# EasyEDA Pro project PCB.epro

# Schematic Schematic1
Board Name: Board1; Create Date: 2025-05-08; Page Name: 底板; Project Name: ESP32-C6红外温度报警底板; Schematic Name: Schematic1; Update Date: 2025-05-09; Company: 嘉立创EDA; Page Size: A4; Version: V1.0
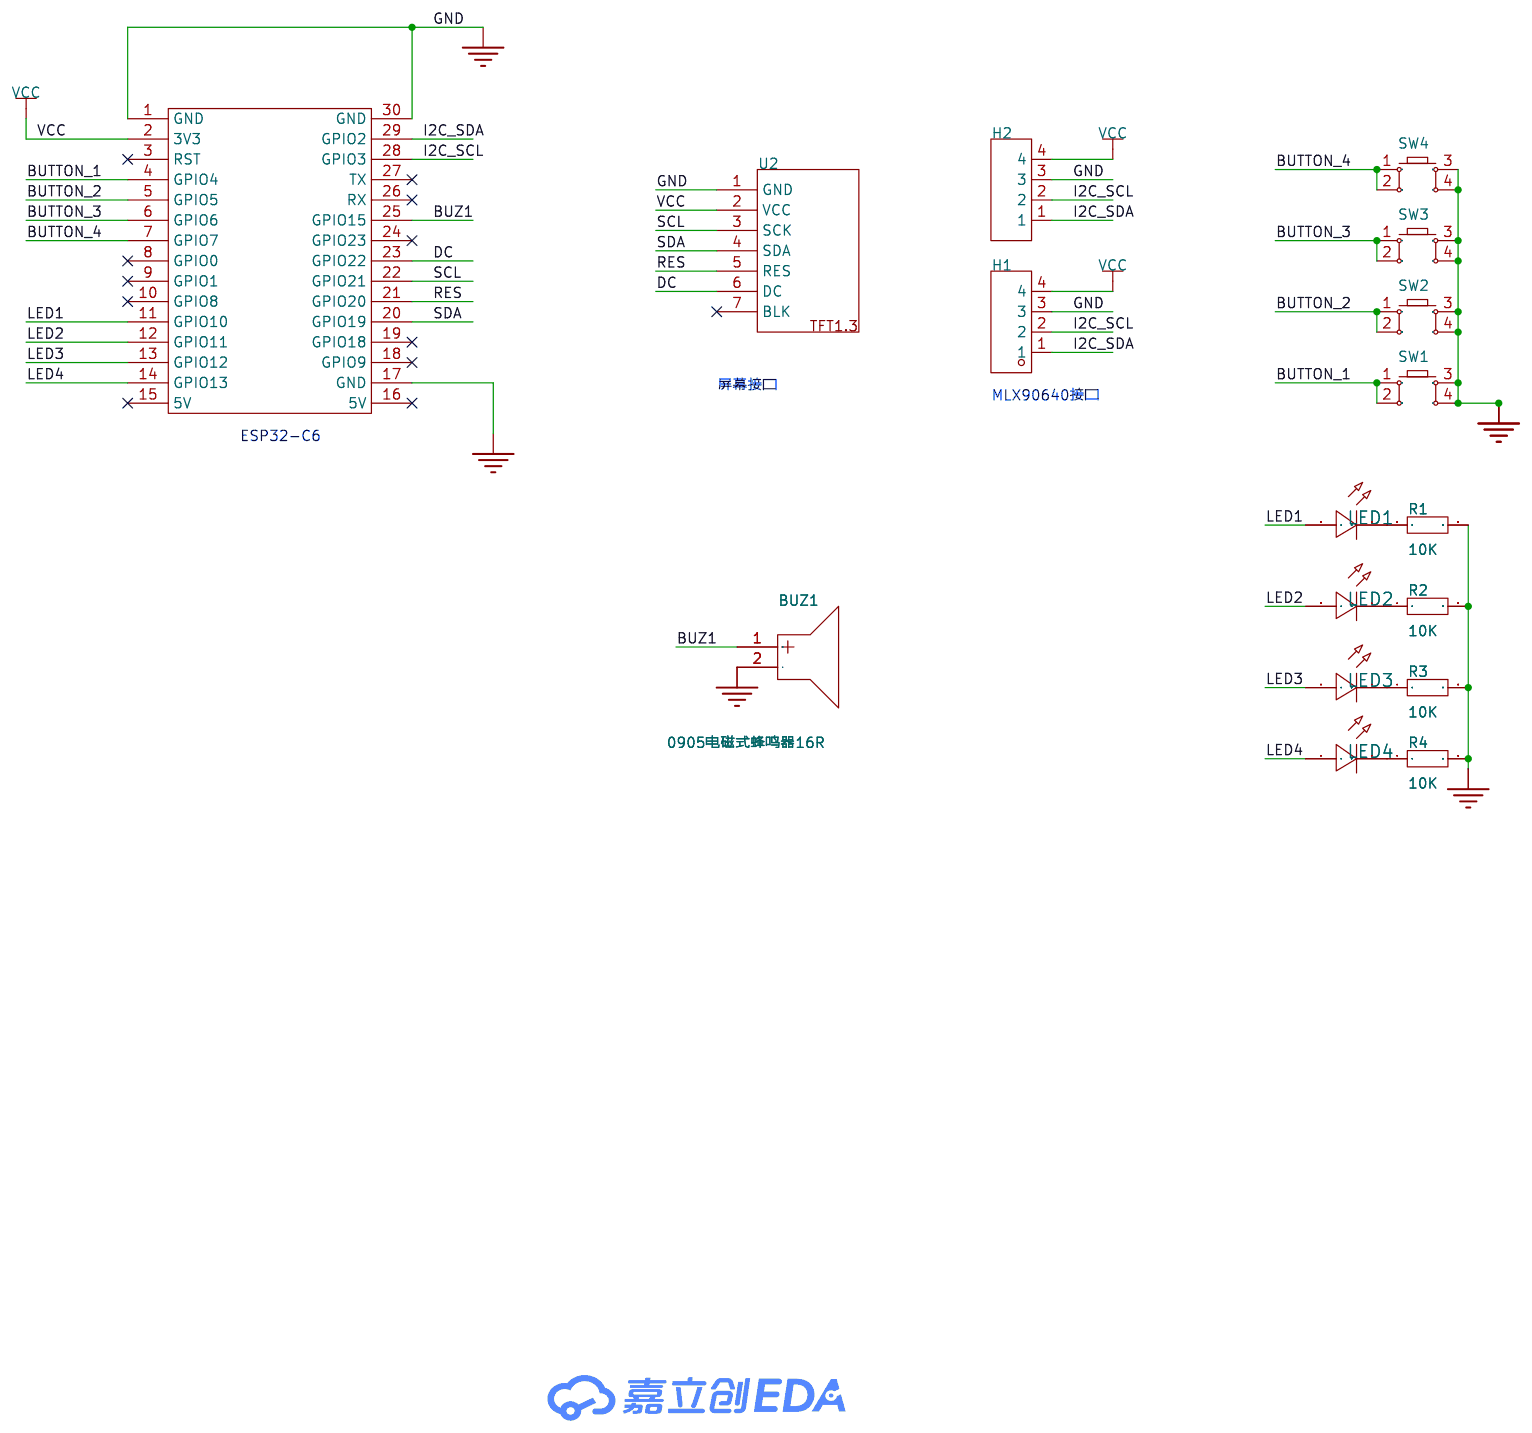
[diagram p0: schematic sheet]

## Parts
BUZ1  0905电磁式蜂鸣器16R  [BUZ-TH_BD9.0-P4.00-D0.6-FD]
H1  -  [HDR-TH_4P-P2.54-V-F]
H2  -  [HDR-TH_4P-P2.54-V-M]
LED1  -  [LED_0603]
LED2  -  [LED_0603]
LED3  -  [LED_0603]
LED4  -  [LED_0603]
R1  10K  [R0603]
R2  10K  [R0603]
R3  10K  [R0603]
R4  10K  [R0603]
SW1  -  [SW-SMD_4P-L6.0-W6.0-P4.50-LS9.0-2]
SW2  -  [SW-SMD_4P-L6.0-W6.0-P4.50-LS9.0-2]
SW3  -  [SW-SMD_4P-L6.0-W6.0-P4.50-LS9.0-2]
SW4  -  [SW-SMD_4P-L6.0-W6.0-P4.50-LS9.0-2]
U2  -  [tft1.3寸]
U3  -  [ESP32-C6-开发板]

## Library data of the parts
BUZ1 = 0905电磁式蜂鸣器16R: Supplier Part: C9900018545; Supplier Footprint: TH-2P; JLCPCB Part Class: 扩展库; Supplier: LCSC
H1 = HDR-F_2.54_1x4P: Supplier Part: C2718488; Supplier Footprint: 插件
H2 = HDR-M_2.54_1x4P: Supplier Part: C492403; Supplier Footprint: 插件
LED1-LED4 = LED_0603-R: Supplier Footprint: 0603
R1-R4 = Res_0603: Supplier Footprint: 0603
SW1-SW4 = Key_SMD_6x6x6.5: Supplier Footprint: SMD
U2 = tft1.3寸
U3 = ESP32-C6-开发板

## Nets
GND: BUZ1.2(-) H1.3 H2.3 R1.2 R2.2 R3.2 R4.2 SW1.3 SW1.4 SW2.3 SW2.4 SW3.3 SW3.4 SW4.3 SW4.4 U2.1(GND) U3.1(GND) U3.17(GND) U3.30(GND)
VCC: H1.4 H2.4 U2.2(VCC) U3.2(3V3)
BUTTON_1: SW1.1 SW1.2 U3.4(GPIO4)
BUTTON_2: SW2.1 SW2.2 U3.5(GPIO5)
BUTTON_3: SW3.1 SW3.2 U3.6(GPIO6)
BUTTON_4: SW4.1 SW4.2 U3.7(GPIO7)
BUZ1: BUZ1.1(+) U3.25(GPIO15)
DC: U2.6(DC) U3.23(GPIO22)
I2C_SCL: H1.2 H2.2 U3.28(GPIO3)
I2C_SDA: H1.1 H2.1 U3.29(GPIO2)
LED1: LED1.2(A) U3.11(GPIO10)
LED2: LED2.2(A) U3.12(GPIO11)
LED3: LED3.2(A) U3.13(GPIO12)
LED4: LED4.2(A) U3.14(GPIO13)
RES: U2.5(RES) U3.21(GPIO20)
SCL: U2.3(SCK) U3.22(GPIO21)
SDA: U2.4(SDA) U3.20(GPIO19)
$1N1669: LED1.1(C) R1.1
$1N1695: LED2.1(C) R2.1
$1N1721: LED3.1(C) R3.1
$1N2832: LED4.1(C) R4.1

Not connected (* = marked no-connect by the designer): U2 7(BLK)*; U3 3(RST)* 8(GPIO0)* 9(GPIO1)* 10(GPIO8)* 15(5V)* 16(5V)* 18(GPIO9)* 19(GPIO18)* 24(GPIO23)* 26(RX)* 27(TX)*

## Notes on the sheet
- 屏幕接口
- MLX90640接口
- ESP32-C6

# Board PCB1
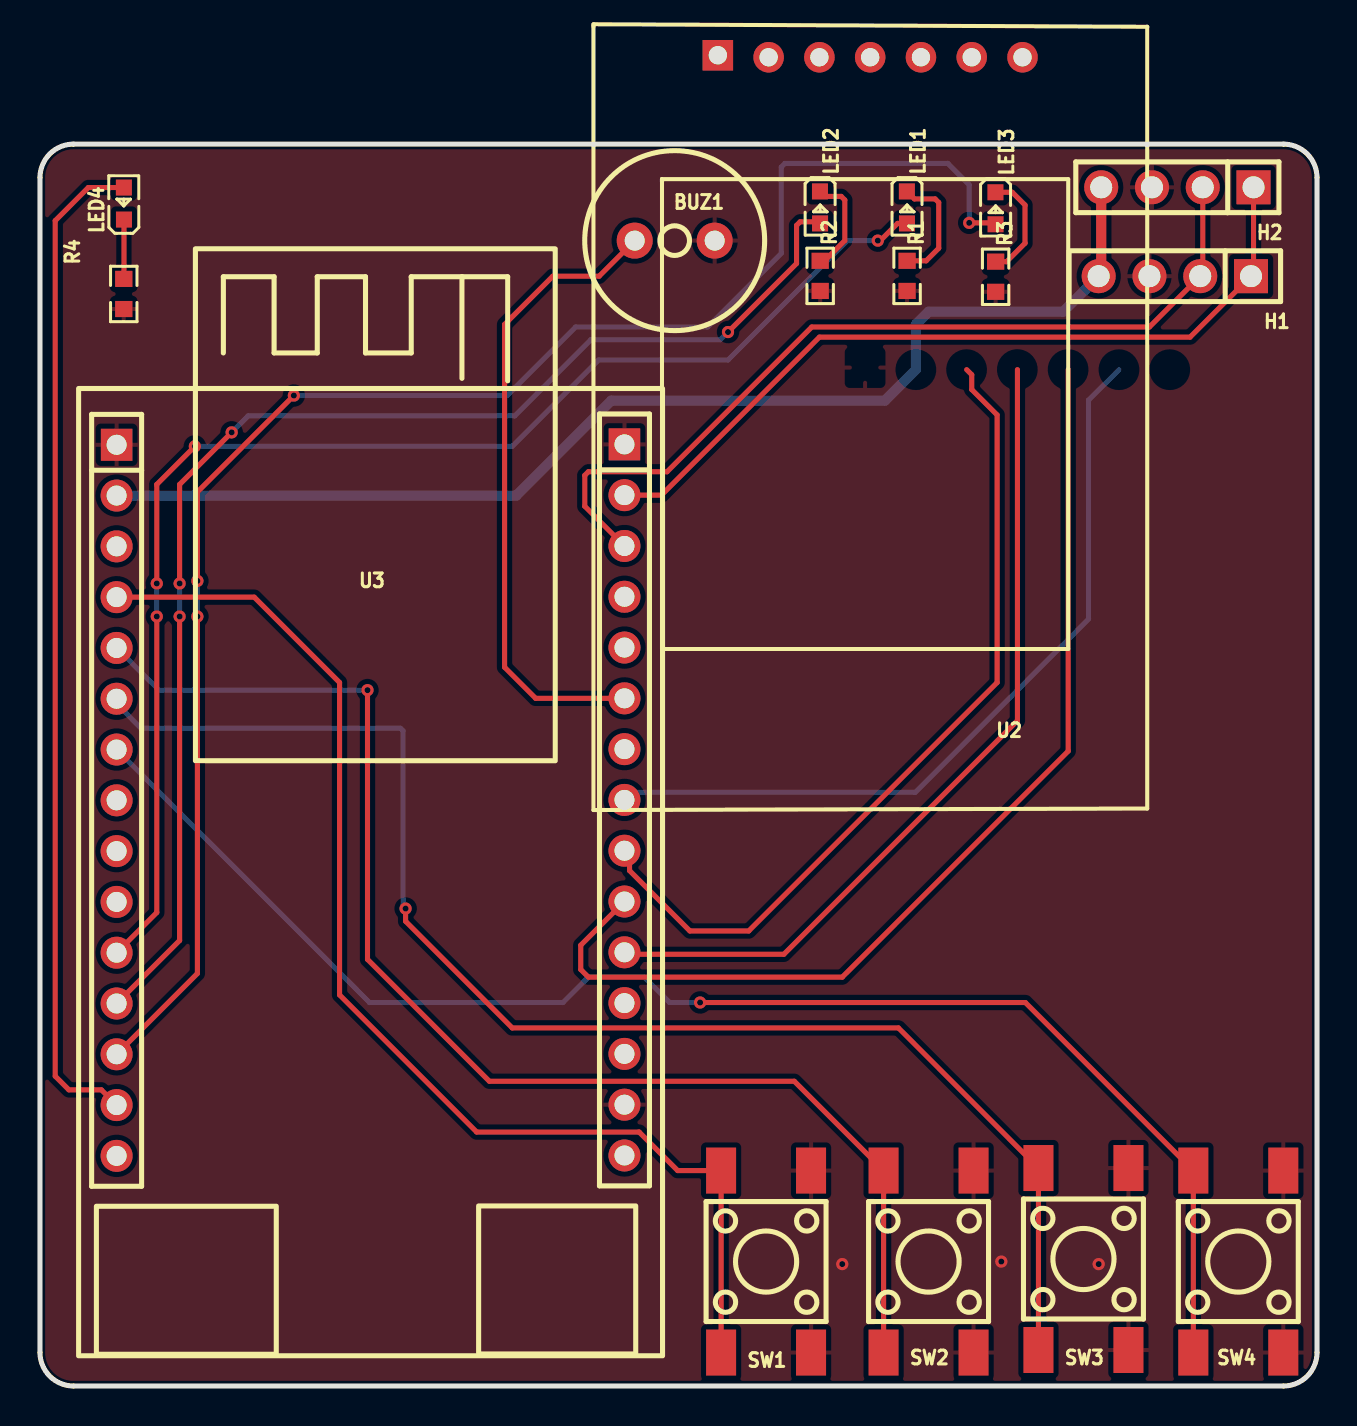
[diagram p1: board, top side]
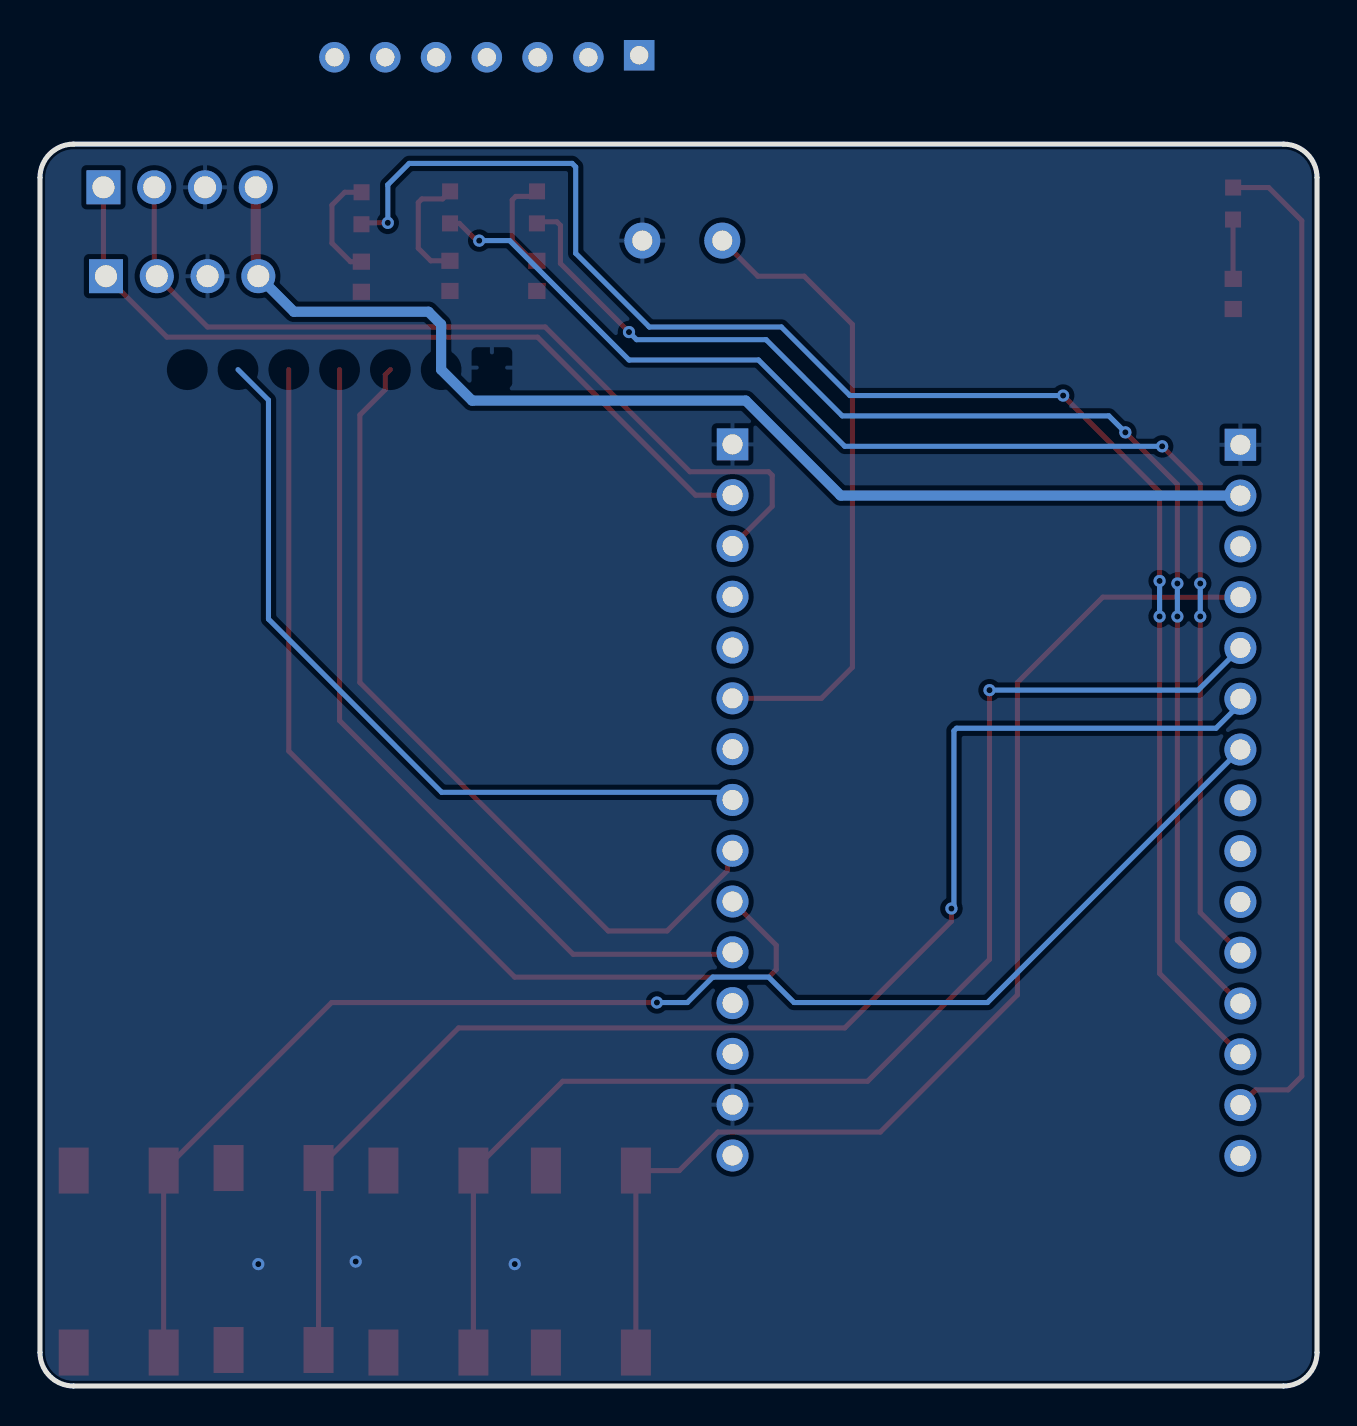
[diagram p2: board, bottom side, seen from below]

Outline 63.88 x 62.1 mm; copper layers: Top Layer, Bottom Layer. Coordinates in mm from the lower left corner of the outline.
Outline path: 0,60.43 0,1.68 arc(0.49,0.49) 1.68,0 62.2,0 arc(63.39,0.49) 63.88,1.68 63.88,60.43 arc(63.39,61.61) 62.2,62.1 1.68,62.1 arc(0.49,61.61) 0,60.43
Stack: Top Layer 0.035mm / Dielectric1 1.51mm FR4 er 4.5 / Bottom Layer 0.035mm

## Design rules (mm)
template: JLCPCB Capability(Two Layers Board)
spacing copperThickness1oz (default): track to track 0.102, other pairs 0.152 to 0.3
spacing copperThickness2oz: track to track 0.203, other pairs 0.152 to 0.3
track width copperThickness1oz (default): min 0.127, default 0.254, max 2.54
track width copperThickness2oz: min 0.203, default 0.254, max 2.54
differential pair differentialPair (default): width min 0.127, default 0.254, max 2.54; gap min 0.152, default 0.152
via viaSize (default): diameter min 0.5, default 0.61, max 10; hole min 0.3, default 0.305, max 6.3

## Placement (name value [footprint] x y rotation side)
BUZ1  0905电磁式蜂鸣器16R  [BUZ-TH_BD9.0-P4.00-D0.6-FD]  31.75 57.28 0 top
H1  -  [HDR-TH_4P-P2.54-V-F]  56.77 55.5 180 top
H2  -  [HDR-TH_4P-P2.54-V-M]  56.9 59.94 180 top
LED1  -  [LED_0603]  43.37 58.89 270 top
LED2  -  [LED_0603]  39.03 58.89 270 top
LED3  -  [LED_0603]  47.8 58.85 270 top
LED4  -  [LED_0603]  4.19 59.18 90 top
R1  10K  [R0603]  43.37 55.51 270 top
R2  10K  [R0603]  39.03 55.51 270 top
R3  10K  [R0603]  47.8 55.47 270 top
R4  10K  [R0603]  4.19 54.61 270 top
SW1  -  [SW-SMD_4P-L6.0-W6.0-P4.50-LS9.0-2]  36.32 6.22 90 top
SW2  -  [SW-SMD_4P-L6.0-W6.0-P4.50-LS9.0-2]  44.45 6.22 90 top
SW3  -  [SW-SMD_4P-L6.0-W6.0-P4.50-LS9.0-2]  52.2 6.35 90 top
SW4  -  [SW-SMD_4P-L6.0-W6.0-P4.50-LS9.0-2]  59.94 6.22 90 top
U2  -  [tft1.3寸]  41.27 50.93 0 top
U3  -  [ESP32-C6-开发板]  17.02 22.23 0 top

## Footprints (pads in the part's own frame, mm; a bottom-side part is the same pattern mirrored in y, then rotated)
BUZ-TH_BD9.0-P4.00-D0.6-FD
  round 1.8 hole 1: 1(-2,0) 2(2,0)
ESP32-C6-开发板
  rect 1.575x1.6 hole 1: 1(-13.184,24.843) 30(12.22,24.863)
  round 1.6 hole 1: 2(-13.184,22.303) 3(-13.184,19.763) 4(-13.184,17.223) 5(-13.184,14.683) 6(-13.184,12.143) 7(-13.184,9.603) 8(-13.184,7.063) 9(-13.184,4.523) 10(-13.184,1.983) 11(-13.184,-0.557) 12(-13.184,-3.097) 13(-13.184,-5.637) 14(-13.184,-8.177) 15(-13.184,-10.717) 16(12.22,-10.697) 17(12.22,-8.157) 18(12.22,-5.617) 19(12.22,-3.077) 20(12.22,-0.537) 21(12.22,2.003) 22(12.22,4.543) 23(12.22,7.083) 24(12.22,9.623) 25(12.22,12.163) 26(12.22,14.703) 27(12.22,17.243) 28(12.22,19.783) 29(12.22,22.323)
HDR-TH_4P-P2.54-V-F
  rect 1.7x1.7 hole 1.1: 1(-3.81,0)
  round 1.7 hole 1.1: 2(-1.27,0) 3(1.27,0) 4(3.81,0)
HDR-TH_4P-P2.54-V-M
  rect 1.7x1.7 hole 1.1: 1(-3.81,0)
  round 1.7 hole 1.1: 2(-1.27,0) 3(1.27,0) 4(3.81,0)
LED_0603
  rect 0.8x0.8 smd: 1(-0.851,-0.01) 2(0.75,-0.005)
R0603
  rect 0.806x0.864 smd: 1(-0.753,0) 2(0.753,0)
SW-SMD_4P-L6.0-W6.0-P4.50-LS9.0-2
  rect 2.3x1.5 smd: 1(-4.55,2.25) 2(4.55,2.25) 3(-4.55,-2.25) 4(4.55,-2.25)
tft1.3寸
  rect 1.524x1.524 hole 0.914: 1(-7.366,15.621)
  round 1.524 hole 0.914: 2(-4.826,15.52) 3(-2.286,15.52) 4(0.254,15.52) 5(2.794,15.52) 6(5.334,15.52) 7(7.874,15.52)

## Nets
As in the schematic.

Pads without a net: U2 7; U3 3 8 9 10 15 16 18 19 24 26 27

## Via types
v1: diameter 0.61, hole 0.305, Top Layer to Bottom Layer, 18 vias

## Routing (per net, layer and track width the routed paths; a pad name or vN(x,y) marks a point on that pad's centre or on a via; arc(x,y) is an arc through that point)
GND:
  vias: v1(40.13,6.1) v1(48.09,6.22) v1(52.96,6.1)
VCC: length 59.5
  Top Layer w0.508: H2.4 53.09,55.63 H1.4
  Bottom Layer w0.508: U3.2 23.83,44.53 28.58,49.28 42.27,49.28 43.81,50.83 43.81,53.09 44.45,53.72 51.18,53.72 H1.4
BUTTON_1: length 60.4
  Top Layer w0.254: SW1.1 SW1.2 31.9,10.77 29.97,12.7 21.84,12.7 14.99,19.56 14.99,35.18 10.72,39.45 U3.4
BUTTON_2: length 66.2
  Top Layer w0.254: SW2.1 SW2.2 37.73,15.24 22.48,15.24 16.38,21.34 v1(16.38,34.8)
  Bottom Layer w0.254: U3.5 5.94,34.8 v1(16.38,34.8)
BUTTON_3: length 70.6
  Top Layer w0.254: v1(18.29,23.88) 18.29,23.24 23.62,17.91 42.94,17.91 SW3.2 SW3.1
  Bottom Layer w0.254: U3.6 3.83,34.11 5.05,32.89 18.03,32.89 18.16,32.77 18.16,24 v1(18.29,23.88)
BUTTON_4: length 72.7
  Top Layer w0.254: v1(33.02,19.18) 49.29,19.18 SW4.2 SW4.1
  Bottom Layer w0.254: 3.83,31.83 16.48,19.18 26.16,19.18 27.43,20.45 30.23,20.45 31.5,19.18 v1(33.02,19.18)
BUZ1: length 32
  Top Layer w0.254: U3.25 24.79,34.39 23.24,35.94 23.24,53.09 25.65,55.5 27.97,55.5 BUZ1.1
DC: length 40.1
  Bottom Layer w0.254: 53.98,50.83 52.45,49.3 52.45,38.35 43.79,29.69 29.62,29.69 U3.23
I2C_SCL: length 43.8
  Top Layer w0.254: 58.17,59.94 58.17,55.63 H1.2 55.5,52.96 38.61,52.96 31.37,45.72 27.43,45.72 27.25,45.54 27.25,43.99 U3.28
I2C_SDA: length 40.4
  Top Layer w0.254: H2.1 60.71,55.63 H1.1 57.53,52.45 38.99,52.45 31.09,44.55 29.24,44.55
LED1: length 67.2
  Top Layer w0.254: v1(5.84,38.48) 5.84,23.68 U3.11 ; v1(7.75,46.99) 5.84,45.09 v1(5.84,40.13) ; v1(41.91,57.28) 42.04,57.28 42.9,58.14 LED1.2
  Bottom Layer w0.254: v1(7.75,46.99) 23.62,46.99 27.94,51.31 34.42,51.31 40.39,57.28 v1(41.91,57.28) ; v1(5.84,38.48) v1(5.84,40.13)
LED2: length 65.9
  Top Layer w0.254: v1(6.98,38.48) 6.98,22.28 U3.12 ; LED2.2 38.94,58.22 38.03,58.22 37.85,58.04 37.85,56.13 v1(34.42,52.71) ; v1(9.59,47.69) 6.98,45.09 v1(6.98,40.13)
  Bottom Layer w0.254: v1(9.59,47.69) 10.41,48.51 23.75,48.51 27.56,52.32 34.04,52.32 v1(34.42,52.71) ; v1(6.98,38.48) v1(6.98,40.13)
LED3: length 81.4
  Top Layer w0.254: v1(46.48,58.17) 47.73,58.17 47.8,58.1 ; v1(7.87,38.48) 7.87,20.63 U3.13 ; v1(12.7,49.53) 7.87,44.7 v1(7.87,40.26)
  Bottom Layer w0.254: v1(12.7,49.53) 23.37,49.53 26.8,52.96 33.4,52.96 37.08,56.64 37.08,60.96 37.26,61.14 45.41,61.14 46.48,60.07 v1(46.48,58.17) ; v1(7.87,38.48) v1(7.87,40.26)
LED4: length 50.6
  Top Layer w0.254: LED4.2 2.42,59.93 0.76,58.28 0.76,15.49 1.45,14.81 3.07,14.81 3.83,14.05
RES: length 52.6
  Top Layer w0.254: U3.21 27.05,22.04 27.05,20.83 27.43,20.45 40.13,20.45 51.43,31.75 51.43,50.83
SCL: length 42.2
  Top Layer w0.254: U3.22 29.49,26.51 29.49,25.77 32.51,22.76 35.45,22.76 47.88,35.18 47.88,48.56 46.61,49.83 46.61,50.57 46.36,50.83
SDA: length 42.1
  Top Layer w0.254: 29.24,21.69 29.34,21.59 37.21,21.59 48.89,33.27 48.89,50.83
$1N1669: length 6
  Top Layer w0.254: R1.1 44.33,56.27 44.96,56.9 44.96,59.18 44.78,59.36 43.74,59.36 LED1.1
$1N1695: length 5.1
  Top Layer w0.254: R2.1 39.25,56.27 40.26,57.28 40.26,59.31 40.08,59.49 39.27,59.49 LED2.1
$1N1721: length 5.5
  Top Layer w0.254: 47.8,56.22 48.35,56.22 49.28,57.15 49.28,59.06 48.64,59.7 LED3.1
$1N2832: length 3
  Top Layer w0.254: R4.1 4.2,55.37 LED4.1

## Copper pours and planes (outline as drawn; the poured copper is in the pictures)
GND on Top Layer: -3.05,65.66 66.17,65.66 66.17,-2.29 -3.05,-2.29
GND on Bottom Layer: -1.91,64.26 65.79,64.26 65.79,-0.89 -1.91,-0.89
